# EAGLE schematic usb_uart (EAGLE 9.6.2)
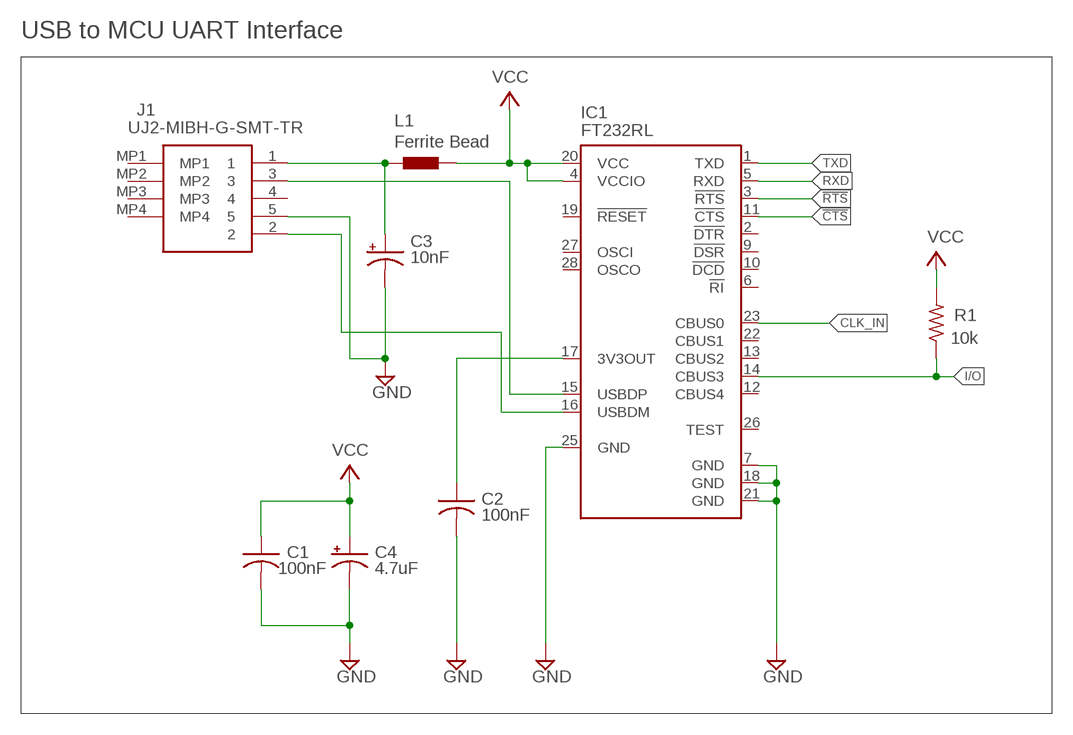
[diagram p0: schematic, sheet 1]

## Parts
C1  100nF  C-USC0402  [C0402]
C2  100nF  C-USC0402  [C0402]
C3  10nF  CPOL-USA  [PANASONIC_A]
C4  4.7uF  CPOL-USD  [PANASONIC_D]
IC1  FT232RL  [SSOP28]
J1  UJ2-MIBH-G-SMT-TR  [UJ2MIBHGSMTTR]
L1  Ferrite Bead  BLM15HB121SN1  [0402]
R1  10k  R-US_R0402  [R0402]

## Nets
!CTS: IC1.11(!CTS)
!RTS: IC1.3(!RTS)
CLK_IN: IC1.23(CBUS0)
GND: C1.2 C2.2 C3.- C4.- IC1.7(GND) IC1.18(GND) IC1.21(GND) IC1.25(GND) J1.5
I/O: IC1.14(CBUS3) R1.1
N$2: C3.+ J1.1 L1.1
N$6: IC1.15(USBDP) J1.3
N$7: IC1.16(USBDM) J1.2
N$8: C2.1 IC1.17(3V3OUT)
RXD: IC1.5(RXD)
TXD: IC1.1(TXD)
VCC: C1.1 C4.+ IC1.4(VCCIO) IC1.20(VCC) L1.2 R1.2
Unconnected: IC1.2(!DTR) IC1.6(!RI) IC1.9(!DSR) IC1.10(!DCD) IC1.12(CBUS4) IC1.13(CBUS2) IC1.19(!RESET) IC1.22(CBUS1) IC1.26(TEST) IC1.27(OSCI) IC1.28(OSCO) J1.4 J1.MP1 J1.MP2 J1.MP3 J1.MP4

## Notes on the sheet
- USB to MCU UART Interface

## Library data of the parts
C1 C2 = rcl:C-US: CAPACITOR, American symbol; SPICEPREFIX: C
C3 C4 = rcl:CPOL-US: POLARIZED CAPACITOR, American symbol; SPICEPREFIX: C
IC1 = ftdichip:FT232R: Source: http://www.ftdichip.com/Documents/DataSheets/DS_FT232R_v104.pdf; MPN: FT232RL; OC_FARNELL: 1146032; OC_NEWARK: 91K9918
J1 = UJ2-MIBH-G-SMT-TR:UJ2-MIBH-G-SMT-TR: USB Connectors Source: Datasheet; DESCRIPTION: USB Connectors; HEIGHT: 3.15mm; MANUFACTURER_NAME: CUI Inc.; MANUFACTURER_PART_NUMBER: UJ2-MIBH-G-SMT-TR; MOUSER_PART_NUMBER: 490-UJ2-MIBH-G-SMTTR; MOUSER_PRICE-STOCK: https://www.mouser.co.uk/ProductDetail/CUI-Devices/UJ2-MIBH-G-SMT-TR?qs=IS%252B4QmGtzzpvS1XQusp0iA%3D%3D
L1 = inductors:BLM15H: EMIFIL (R) Chip Ferrite Bead for GHz Noise Source: http://www.murata.com/ Ferrite Bead BLM15H.pdf
R1 = rcl:R-US_: RESISTOR, American symbol; SPICEPREFIX: R